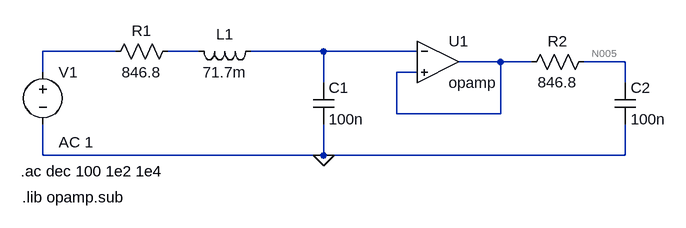
[diagram p0: schematic TS3.asc]
TS3.asc, the LTspice schematic file:
Version 4
SHEET 1 880 680
WIRE -128 48 -240 48
WIRE 0 48 -48 48
WIRE 192 48 80 48
WIRE 336 48 192 48
WIRE 464 64 400 64
WIRE 512 64 464 64
WIRE 656 64 592 64
WIRE -240 80 -240 48
WIRE 336 80 304 80
WIRE 192 96 192 48
WIRE 656 96 656 64
WIRE 304 144 304 80
WIRE 464 144 464 64
WIRE 464 144 304 144
WIRE -240 208 -240 160
WIRE 192 208 192 160
WIRE 192 208 -240 208
WIRE 656 208 656 160
WIRE 656 208 192 208
FLAG 192 208 0
SYMBOL res -32 32 R90
WINDOW 0 0 56 VBottom 2
WINDOW 3 32 56 VTop 2
SYMATTR InstName R1
SYMATTR Value 846.8
SYMBOL ind 96 32 R90
WINDOW 0 5 56 VBottom 2
WINDOW 3 32 56 VTop 2
SYMATTR InstName L1
SYMATTR Value 71.7m
SYMBOL cap 176 96 R0
SYMATTR InstName C1
SYMATTR Value 100n
SYMBOL voltage -240 64 R0
WINDOW 123 24 124 Left 2
WINDOW 39 0 0 Left 2
SYMATTR InstName V1
SYMATTR Value ""
SYMATTR Value2 AC 1
SYMBOL Opamps\\opamp 368 0 R0
SYMATTR InstName U1
SYMBOL res 608 48 R90
WINDOW 0 0 56 VBottom 2
WINDOW 3 32 56 VTop 2
SYMATTR InstName R2
SYMATTR Value 846.8
SYMBOL cap 640 96 R0
SYMATTR InstName C2
SYMATTR Value 100n
TEXT -274 232 Left 2 !.ac dec 100 1e2 1e4
TEXT -272 272 Left 2 !.lib opamp.sub

The netlist it stands for:
* TS3.asc
R1 N002 N001 846.8
L1 N003 N002 71.7m
C1 N003 0 100n
V1 N001 0 AC 1
XU1 N003 N004 N004 opamp Aol=100K GBW=10Meg  ; pins invin noninvin out
R2 N005 N004 846.8
C2 N005 0 100n
.ac dec 100 1e2 1e4
.lib opamp.sub
.backanno
.end

* Results of the author's LTspice run, read from the files saved beside the schematic
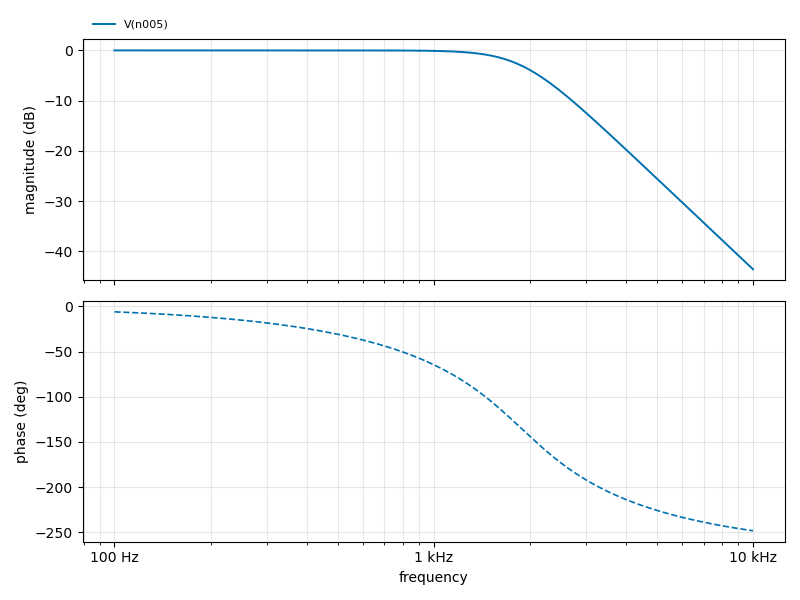
[diagram p1: AC Analysis of TS3.asc, plotted from the saved traces]
* AC Analysis, 1 run:
*   V(n005): 0.00 dB at 100 Hz, -43.56 dB at 10 kHz, peak 0.00 dB at 100 Hz, 3 dB below the peak at 1.879 kHz